# Altium schematic sheet SG_Amplifiers_LTC2053(120).SchDoc
size A
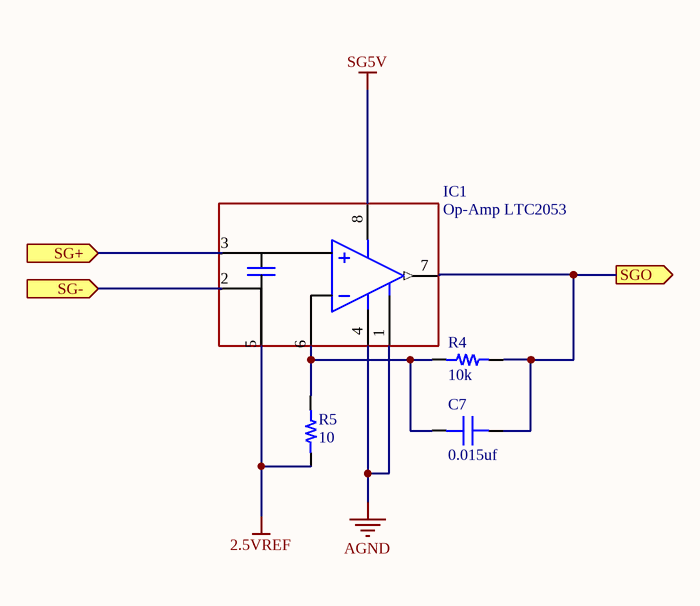
[diagram p0: SG_Amplifiers_LTC2053(120).SchDoc]

## Parts
C7  value 0.015uf  [CAP 0603/1608]  (hidden comment: Capacitor MLCC 0.015uf 25V CAP 0603/1608)
IC1  Op-Amp LTC2053  [MSOP-8]
R4  value 10k  [RES 0603/1608]  (hidden comment: Resistor 10k 0603 1/10W 1%)
R5  value 10  [RES 0603/1608]  (hidden comment: Resistor 10 0603 1/10W 1%)

## Ports
SG+ (in), SG- (in), SGO (out)

## Nets
2.5VREF: IC1.5(REF) R5.1
AGND: IC1.1 IC1.4(V-)
SG5V: IC1.8(V+)
SG+: IC1.3(+IN) ; port SG+
SG-: IC1.2(-IN) ; port SG-
SGO: C7.2 IC1.7(OUT) R4.2 ; port SGO
NetC7_1: C7.1 IC1.6(RG) R4.1 R5.2

## Library data of the parts
C7 = 578: Manufacturer_id: 1; idCapacitor: 578; Name: Cap_0.015uf_25V_CAP 0603/1608; Dielectric: Ceramic; Created_By: Nick Mah; Drawer_id: 1; Voltage_Rating: 25V; Package: CAP 0603/1608; Created_Date: 10/20/2018
IC1 = 2: Manufacturer_id: 1; idOp_Amp: 2; Name: Instrumentation Amplifier; Amplifier_Type: Instrumentation; Supply_Voltage: 2.7V to ±5.5V; Created_By: Angel Delgado; Drawer_id: 1; Num_Circuits: 1; Package: MSOP8; MfrPartNo: LTC2053; Link: https://www.digikey.com/product-detail/en/linear-technology-analog-devices/LTC2053CMS8-TRPBF/LTC2053CMS8-TRPBFCT-ND/5892339
R4 = 313: Manufacturer_id: 1; idResistor: 313; Name: Res_10k_0603_1/10W_1%; Created_By: Nick Mah; Supplier 1: Digi-Key; Drawer_id: 1; Tolerance: 1%; Power: 1/10W; Package: 0603; ComponentLink1Description: Datasheet; Created_Date: 2018-10-20
R5 = 241: Manufacturer_id: 1; idResistor: 241; Name: Res_10_0603_1/10W_1%; Created_By: Nick Mah; Supplier 1: Digi-Key; Drawer_id: 1; Tolerance: 1%; Power: 1/10W; Package: 0603; ComponentLink1Description: Datasheet; Created_Date: 2018-10-20